# Altium schematic sheet Serial Com Module.SchDoc
size Letter
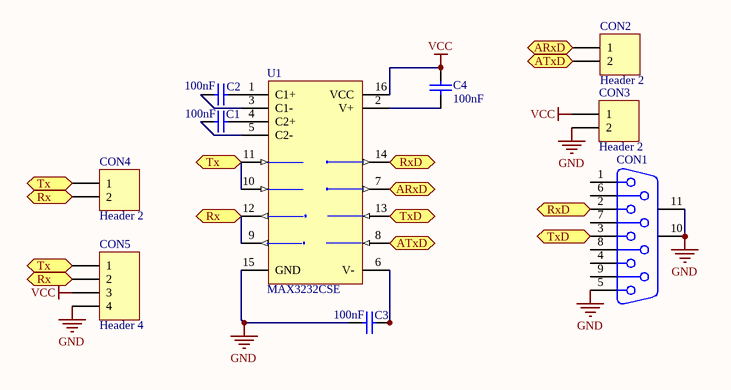
[diagram p0: Serial Com Module.SchDoc]

## Parts
C1  value 100nF  [4532[1812]]  (hidden comment: Cap)
C2  value 100nF  [4532[1812]]  (hidden comment: Cap)
C3  value 100nF  [4532[1812]]  (hidden comment: Cap)
C4  value 100nF  [4532[1812]]  (hidden comment: Cap)
CON1  D Connector 9  [DSUB1.385-2H9]  (value not drawn)
CON2  Header 2  [HDR1X2]
CON3  Header 2  [HDR1X2]
CON4  Header 2  [HDR1X2]
CON5  Header 4  [HDR1X4]
U1  MAX3232CSE  [NSO16_N]

## Ports
ARxD, ATxD, Rx, RxD, Tx, TxD

## Nets
GND: C3.2 CON1.5 CON1.10(MH1) CON1.11(MH2) CON3.2 CON5.4 U1.15(GND)
VCC: C4.1 CON3.1 CON5.3 U1.16(VCC)
ARxD: CON2.1 U1.7(T2OUT) ; port ARxD
ATxD: CON2.2 U1.8(R2IN) ; port ATxD
Rx: CON4.2 CON5.2 U1.9(R2OUT) U1.12(R1OUT) ; port Rx
RxD: CON1.2 U1.14(T1OUT) ; port RxD
Tx: CON4.1 CON5.1 U1.10(T2IN) U1.11(T1IN) ; port Tx
TxD: CON1.3 U1.13(R1IN) ; port TxD
NetC1_1: C1.1 U1.4(C2+)
NetC1_2: C1.2 U1.5(C2-)
NetC2_1: C2.1 U1.1(C1+)
NetC2_2: C2.2 U1.3(C1-)
NetC3_1: C3.1 U1.6(V-)
NetC4_2: C4.2 U1.2(V+)

Not connected (* = marked no-connect by the designer): CON1 1 4 6 7 8 9

## Library data of the parts
C1-C4 = Cap: Capacitor; Published: 8-Jun-2000; LatestRevisionDate: 17-Jul-2002; LatestRevisionNote: Re-released for DXP Platform.; PackageReference: RAD-0.3; Publisher: Altium Limited; PackageDescription: Radial Cap, Thru-Hole; 2 Leads; 0.3 in Pin Spacing
CON1 = D Connector 9: Receptacle Assembly, 9 Position, Right Angle; PackageDocument: O; Positions: 9; Published: 15-Jun-2001; LatestRevisionDate: 17-Jul-2002; LatestRevisionNote: Re-released for DXP Platform.; DatasheetDocument: 1-Sep-1999; PackageReference: 788750; Publisher: Altium Limited; Orientation: Right Angle; Gender: Receptacle
CON2-CON4 = Header 2: Header, 2-Pin; LatestRevisionDate: 17-Jul-2002; LatestRevisionNote: Re-released for DXP Platform.; Publisher: Altium Limited
CON5 = Header 4: Header, 4-Pin; LatestRevisionDate: 17-Jul-2002; LatestRevisionNote: Re-released for DXP Platform.; Publisher: Altium Limited
U1 = MAX3232CSE: 3.0V TO 5.5V, Low-Power, up to 1Mbps, True RS-232 Transceiver Using Four 0.1µF External Capacitor; Published: 16-Jan-2001; LatestRevisionDate: 13-Apr-2006; LatestRevisionNote: IPC-7351 Footprint Added.; DatasheetVersion: Mar-1999; PackageReference: NSO16; Publisher: Altium Limited; PackageDescription: 16-Pin Small Outline Integrated Circuit 1.27 mm Pitch; Code_JEDEC: MS-012-AC; Code_IPC: SOIC127P600-16; ComponentLink1Description: Manufacturer Link; ComponentLink1URL: http://www.maxim-ic.com/; ComponentLink2Description: Datasheet; ComponentLink2URL: http://pdfserv.maxim-ic.com/en/ds/MAX3222-MAX3241.pdf